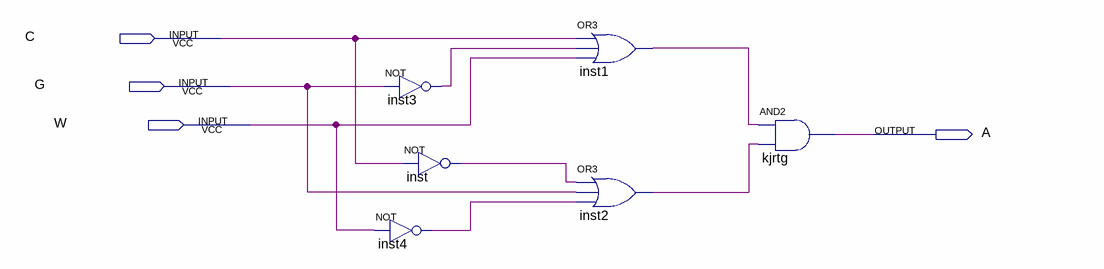
[diagram p0: schematic sheet]
// Quartus schematic lab3step0.bdf as structural Verilog: 6 symbols, 4 pins
module lab3step0 (
  input  C,
  input  G,
  input  W,
  output A
);

  wire inst1_out, inst2_out, inst3_out, inst4_out, inst_out;

  not inst3 (inst3_out, G);
  not inst (inst_out, C);
  not inst4 (inst4_out, W);
  or inst1 (inst1_out, C, inst3_out, W);
  or inst2 (inst2_out, inst_out, G, inst4_out);
  and kjrtg (A, inst1_out, inst2_out);
endmodule
